# Altium project Diseño_Cargador.PrjPcb
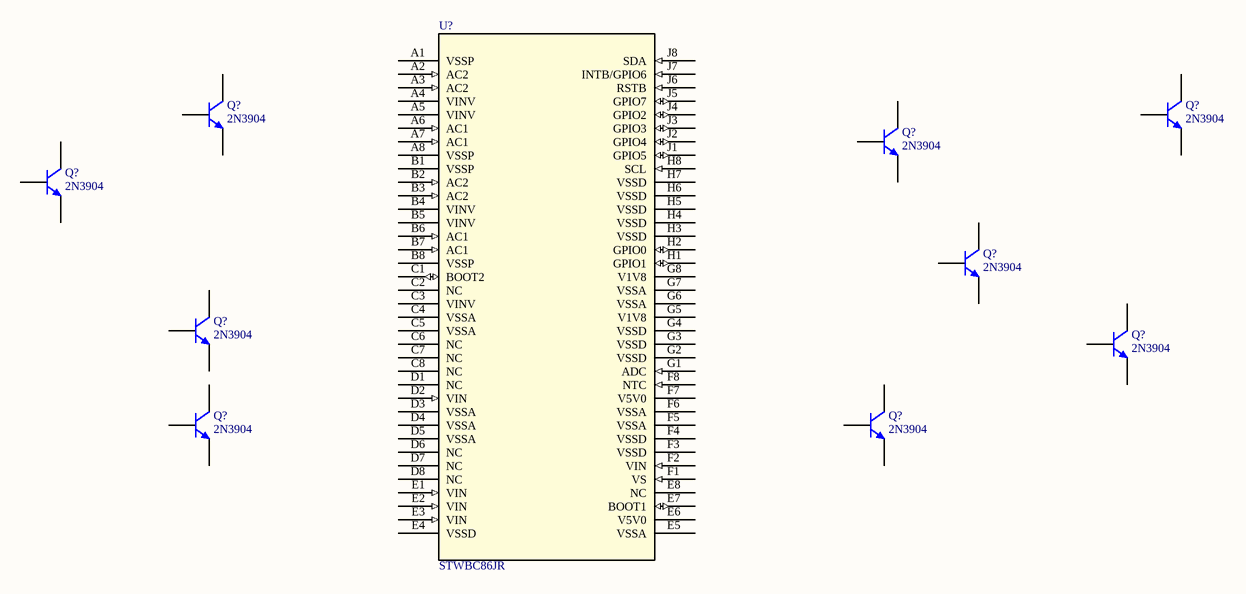
[diagram p0: Sheet1.SchDoc]
1 sheet, 10 parts. Net scope: global (net labels, ports and power ports of the same name join across sheets).

## Sheet Sheet1.SchDoc
size A4

### Parts
(Parts that share a designator on the sheet are numbered #1, #2 ... from top to bottom, then left to right.)
Q?#1  2N3904  [TO-92A]
Q?#2  2N3904  [TO-92A]
Q?#3  2N3904  [TO-92A]
Q?#4  2N3904  [TO-92A]
Q?#5  2N3904  [TO-92A]
Q?#6  2N3904  [TO-92A]
Q?#7  2N3904  [TO-92A]
Q?#8  2N3904  [TO-92A]
Q?#9  2N3904  [TO-92A]
U?  STWBC86JR  [BGA72_STWBC_STM]

### Nets

Not connected (* = marked no-connect by the designer): Q?#1 1(E) 2(B) 3(C); Q?#2 1(E) 2(B) 3(C); Q?#3 1(E) 2(B) 3(C); Q?#4 1(E) 2(B) 3(C); Q?#5 1(E) 2(B) 3(C); Q?#6 1(E) 2(B) 3(C); Q?#7 1(E) 2(B) 3(C); Q?#8 1(E) 2(B) 3(C); Q?#9 1(E) 2(B) 3(C); U? A1(VSSP) A2(AC2) A3(AC2) A4(VINV) A5(VINV) A6(AC1) A7(AC1) A8(VSSP) B1(VSSP) B2(AC2) B3(AC2) B4(VINV) B5(VINV) B6(AC1) B7(AC1) B8(VSSP) C1(BOOT2) C2(NC) C3(VINV) C4(VSSA) C5(VSSA) C6(NC) C7(NC) C8(NC) D1(NC) D2(VIN) D3(VSSA) D4(VSSA) D5(VSSA) D6(NC) D7(NC) D8(NC) E1(VIN) E2(VIN) E3(VIN) E4(VSSD) E5(VSSA) E6(V5V0) E7(BOOT1) E8(NC) F1(VS) F2(VIN) F3(VSSD) F4(VSSD) F5(VSSA) F6(VSSA) F7(V5V0) F8(NTC) G1(ADC) G2(VSSD) G3(VSSD) G4(VSSD) G5(V1V8) G6(VSSA) G7(VSSA) G8(V1V8) H1(GPIO1) H2(GPIO0) H3(VSSD) H4(VSSD) H5(VSSD) H6(VSSD) H7(VSSD) H8(SCL) J1(GPIO5) J2(GPIO4) J3(GPIO3) J4(GPIO2) J5(GPIO7) J6(RSTB) J7(INTB/GPIO6) J8(SDA)

### Library data of the parts
Q?#1-Q?#9 = 2N3904: NPN General Purpose Amplifier; Published: 8-Jun-2000; LatestRevisionDate: 15-Jan-2003; LatestRevisionNote: PCB Footprint 'BCY-W3/D4.7' replaced; DatasheetVersion: 1997; PackageVersion: Sep-1998; PackageReference: TO-92A; Publisher: Altium Limited; PackageDescription: TO, Flat Index; 3 In-Line, Axial Leads; Body Dia. 4.5mm; Leads 0.51 x 0.48 mm (max); ComponentLink1Description: Manufacturer Link; ComponentLink1URL: http://www.fairchildsemi.com/; ComponentLink2Description: Datasheet; ComponentLink2URL: http://www.fairchildsemi.com/ds/2N%2F2N3904.pdf
U? = STWBC86JR: No Description Available; Mfr_Name: STMicroelectronics; Type: Power Management; RefDes: RefDes